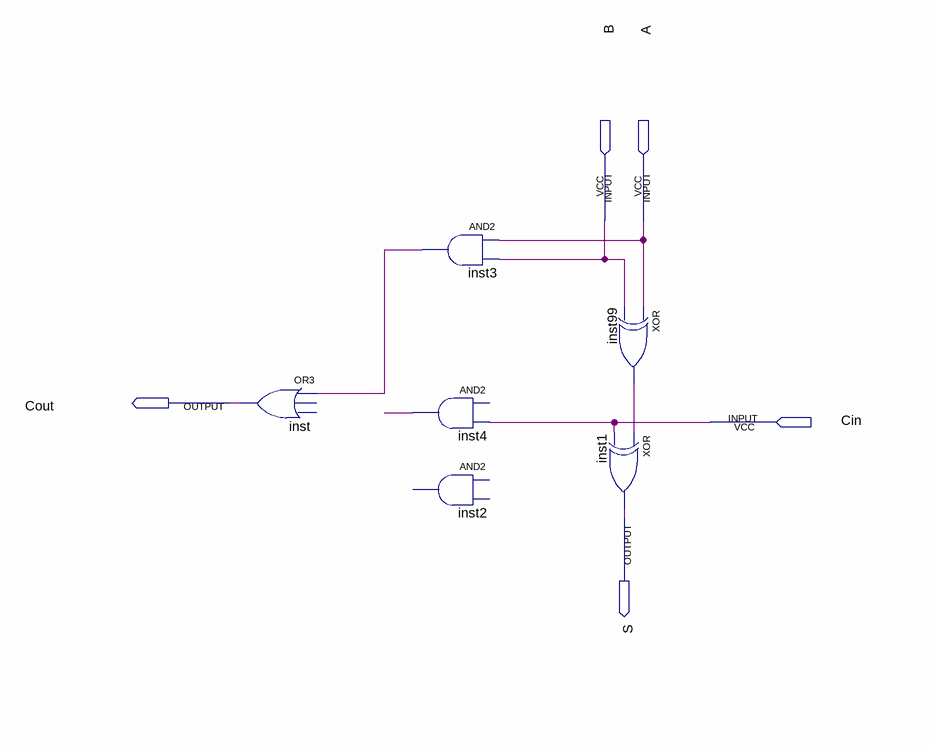
[diagram p0: schematic sheet]
// Quartus schematic comp2_uni.bdf as structural Verilog: 6 symbols, 5 pins
module comp2_uni (
  input  B,
  input  A,
  input  Cin,
  output Cout,
  output S
);

  wire inst3_out, inst4_out, inst99_out;

  buf inst (Cout, inst3_out);  // OR3 open: IN2, IN3
  and inst3 (inst3_out, A, B);
  buf inst4 (inst4_out, Cin);  // AND2 open: IN1
  // AND2 inst2 is placed but not wired
  xor inst99 (inst99_out, A, B);
  xor inst1 (S, inst99_out, Cin);
endmodule
